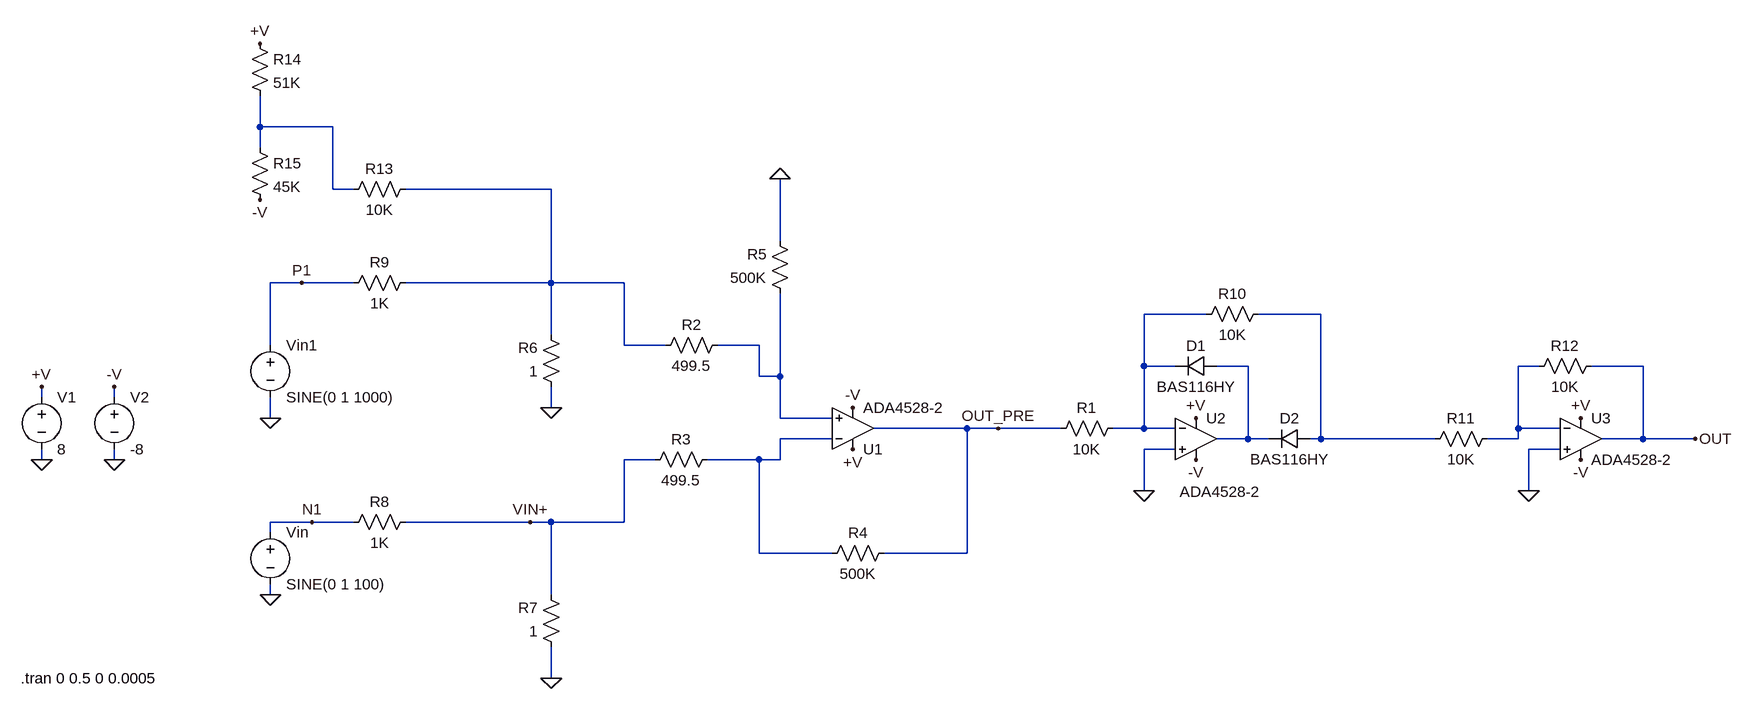
[diagram p0: schematic 20250720-Dense-ADA4528-2.asc]
20250720-Dense-ADA4528-2.asc, the LTspice schematic file:
Version 4.1
SHEET 1 2884 700
WIRE 288 -1680 288 -1728
WIRE 400 -1680 288 -1680
WIRE 288 -1648 288 -1680
WIRE 400 -1584 400 -1680
WIRE 432 -1584 400 -1584
WIRE 736 -1584 512 -1584
WIRE 1088 -1504 1088 -1600
WIRE 352 -1440 304 -1440
WIRE 432 -1440 352 -1440
WIRE 736 -1440 736 -1584
WIRE 736 -1440 512 -1440
WIRE 848 -1440 736 -1440
WIRE 1744 -1392 1648 -1392
WIRE 1920 -1392 1824 -1392
WIRE 736 -1360 736 -1440
WIRE 304 -1344 304 -1440
WIRE 848 -1344 848 -1440
WIRE 912 -1344 848 -1344
WIRE 1056 -1344 992 -1344
WIRE 1648 -1312 1648 -1392
WIRE 1696 -1312 1648 -1312
WIRE 1808 -1312 1760 -1312
WIRE 2256 -1312 2224 -1312
WIRE 2416 -1312 2336 -1312
WIRE 1056 -1296 1056 -1344
WIRE 1088 -1296 1088 -1424
WIRE 1088 -1296 1056 -1296
WIRE -48 -1264 -48 -1280
WIRE 64 -1264 64 -1280
WIRE 736 -1248 736 -1280
WIRE 304 -1232 304 -1264
WIRE 1088 -1232 1088 -1296
WIRE 1168 -1232 1088 -1232
WIRE 1376 -1216 1232 -1216
WIRE 1424 -1216 1376 -1216
WIRE 1520 -1216 1424 -1216
WIRE 1648 -1216 1648 -1312
WIRE 1648 -1216 1600 -1216
WIRE 1696 -1216 1648 -1216
WIRE 2224 -1216 2224 -1312
WIRE 2288 -1216 2224 -1216
WIRE 1168 -1200 1088 -1200
WIRE 1808 -1200 1808 -1312
WIRE 1808 -1200 1760 -1200
WIRE 1840 -1200 1808 -1200
WIRE 1920 -1200 1920 -1392
WIRE 1920 -1200 1904 -1200
WIRE 2096 -1200 1920 -1200
WIRE 2224 -1200 2224 -1216
WIRE 2224 -1200 2176 -1200
WIRE 2416 -1200 2416 -1312
WIRE 2416 -1200 2352 -1200
WIRE 2496 -1200 2416 -1200
WIRE 1696 -1184 1648 -1184
WIRE 2288 -1184 2240 -1184
WIRE -48 -1168 -48 -1184
WIRE 64 -1168 64 -1184
WIRE 896 -1168 848 -1168
WIRE 1056 -1168 976 -1168
WIRE 1088 -1168 1088 -1200
WIRE 1088 -1168 1056 -1168
WIRE 1648 -1120 1648 -1184
WIRE 2240 -1120 2240 -1184
WIRE 368 -1072 304 -1072
WIRE 432 -1072 368 -1072
WIRE 704 -1072 512 -1072
WIRE 736 -1072 704 -1072
WIRE 848 -1072 848 -1168
WIRE 848 -1072 736 -1072
WIRE 304 -1056 304 -1072
WIRE 1056 -1024 1056 -1168
WIRE 1168 -1024 1056 -1024
WIRE 1376 -1024 1376 -1216
WIRE 1376 -1024 1248 -1024
WIRE 304 -960 304 -976
WIRE 736 -960 736 -1072
WIRE 736 -832 736 -880
FLAG -48 -1280 +V
FLAG -48 -1168 0
FLAG 304 -960 0
FLAG 1200 -1184 +V
FLAG 64 -1280 -V
FLAG 1200 -1248 -V
FLAG 64 -1168 0
FLAG 1088 -1600 0
FLAG 736 -1248 0
FLAG 736 -832 0
FLAG 1424 -1216 OUT_PRE
FLAG 704 -1072 VIN+
FLAG 304 -1232 0
FLAG 1648 -1120 0
FLAG 1728 -1168 -V
FLAG 1728 -1232 +V
FLAG 2240 -1120 0
FLAG 2496 -1200 OUT
FLAG 2320 -1232 +V
FLAG 2320 -1168 -V
FLAG 352 -1440 P1
FLAG 368 -1072 N1
FLAG 288 -1808 +V
FLAG 288 -1568 -V
SYMBOL voltage -48 -1280 R0
WINDOW 123 0 0 Left 2
WINDOW 39 0 0 Left 2
SYMATTR InstName V1
SYMATTR Value 8
SYMBOL voltage 304 -1072 R0
WINDOW 123 24 146 Left 2
WINDOW 39 24 125 Left 2
SYMATTR InstName Vin
SYMATTR Value SINE(0 1 100)
SYMBOL res 1008 -1360 R90
WINDOW 0 0 56 VBottom 2
WINDOW 3 32 56 VTop 2
SYMATTR InstName R2
SYMATTR Value 499.5
SYMBOL Opamps\\ADA4528-2 1200 -1152 M180
SYMATTR InstName U1
SYMBOL voltage 64 -1280 R0
WINDOW 123 24 146 Left 2
WINDOW 39 24 125 Left 2
SYMATTR InstName V2
SYMATTR Value -8
SYMBOL res 992 -1184 R90
WINDOW 0 0 56 VBottom 2
WINDOW 3 32 56 VTop 2
SYMATTR InstName R3
SYMATTR Value 499.5
SYMBOL res 1264 -1040 R90
WINDOW 0 0 56 VBottom 2
WINDOW 3 32 56 VTop 2
SYMATTR InstName R4
SYMATTR Value 500K
SYMBOL res 1104 -1408 R180
WINDOW 0 36 76 Left 2
WINDOW 3 36 40 Left 2
SYMATTR InstName R5
SYMATTR Value 500K
SYMBOL res 752 -1264 R180
WINDOW 0 36 76 Left 2
WINDOW 3 36 40 Left 2
SYMATTR InstName R6
SYMATTR Value 1
SYMBOL res 752 -864 R180
WINDOW 0 36 76 Left 2
WINDOW 3 36 40 Left 2
SYMATTR InstName R7
SYMATTR Value 1
SYMBOL res 416 -1056 R270
WINDOW 0 32 56 VTop 2
WINDOW 3 0 56 VBottom 2
SYMATTR InstName R8
SYMATTR Value 1K
SYMBOL res 416 -1424 R270
WINDOW 0 32 56 VTop 2
WINDOW 3 0 56 VBottom 2
SYMATTR InstName R9
SYMATTR Value 1K
SYMBOL voltage 304 -1360 R0
WINDOW 123 24 146 Left 2
WINDOW 39 24 125 Left 2
SYMATTR InstName Vin1
SYMATTR Value SINE(0 1 1000)
SYMBOL res 1504 -1200 R270
WINDOW 0 32 56 VTop 2
WINDOW 3 0 56 VBottom 2
SYMATTR InstName R1
SYMATTR Value 10K
SYMBOL res 1728 -1376 R270
WINDOW 0 32 56 VTop 2
WINDOW 3 0 56 VBottom 2
SYMATTR InstName R10
SYMATTR Value 10K
SYMBOL diode 1760 -1328 R90
WINDOW 0 0 32 VBottom 2
WINDOW 3 32 32 VTop 2
SYMATTR InstName D1
SYMATTR Value BAS116HY
SYMBOL Opamps\\ADA4528-2 1728 -1264 R0
WINDOW 3 -25 145 Left 2
SYMATTR InstName U2
SYMBOL diode 1904 -1216 R90
WINDOW 0 0 32 VBottom 2
WINDOW 3 32 32 VTop 2
SYMATTR InstName D2
SYMATTR Value BAS116HY
SYMBOL Opamps\\ADA4528-2 2320 -1264 R0
SYMATTR InstName U3
SYMBOL res 2080 -1184 R270
WINDOW 0 32 56 VTop 2
WINDOW 3 0 56 VBottom 2
SYMATTR InstName R11
SYMATTR Value 10K
SYMBOL res 2240 -1296 R270
WINDOW 0 32 56 VTop 2
WINDOW 3 0 56 VBottom 2
SYMATTR InstName R12
SYMATTR Value 10K
SYMBOL res 416 -1568 R270
WINDOW 0 32 56 VTop 2
WINDOW 3 0 56 VBottom 2
SYMATTR InstName R13
SYMATTR Value 10K
SYMBOL res 272 -1824 R0
SYMATTR InstName R14
SYMATTR Value 51K
SYMBOL res 272 -1664 R0
SYMATTR InstName R15
SYMATTR Value 45K
TEXT -80 -832 Left 2 !.tran 0 0.5 0 0.0005

The netlist it stands for:
* 20250720-Dense-ADA4528-2.asc
V1 +V 0 8
Vin N1 0 SINE(0 1 100)
R2 N005 N002 499.5
X§U1 N005 N008 +V -V OUT_PRE ADA4528-2  ; pins In+ In- V+ V- OUT
V2 -V 0 -8
R3 N008 VIN+ 499.5
R4 OUT_PRE N008 500K
R5 N005 0 500K
R6 0 N002 1
R7 0 VIN+ 1
R8 N1 VIN+ 1K
R9 P1 N002 1K
Vin1 P1 0 SINE(0 1 1000)
R1 OUT_PRE N003 10K
R10 N003 N004 10K
D1 N006 N003 BAS116HY
X§U2 0 N003 +V -V N006 ADA4528-2  ; pins In+ In- V+ V- OUT
D2 N004 N006 BAS116HY
X§U3 0 N007 +V -V OUT ADA4528-2  ; pins In+ In- V+ V- OUT
R11 N004 N007 10K
R12 N007 OUT 10K
R13 N001 N002 10K
R14 +V N001 51K
R15 N001 -V 45K
.model D D
.lib standard.dio
.tran 0 0.5 0 0.0005
.backanno
.end